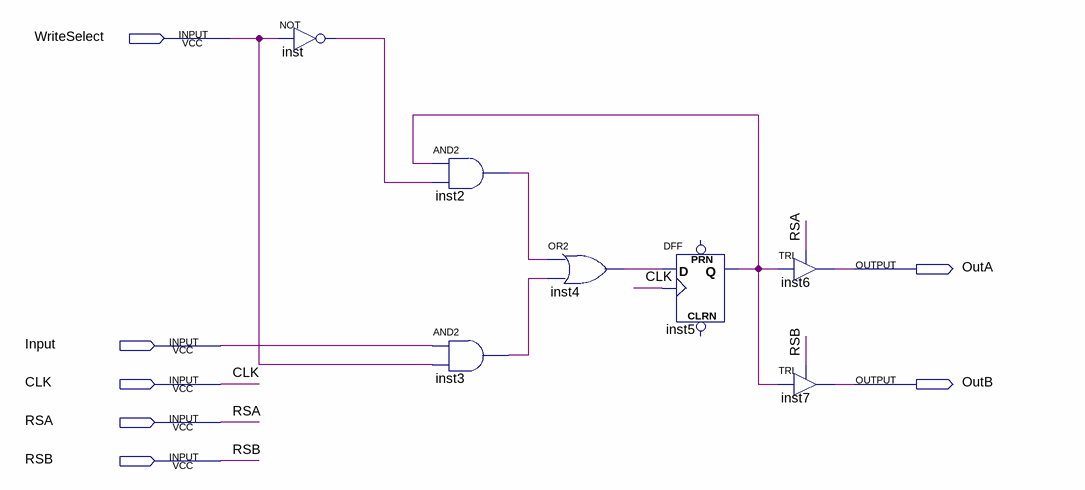
[diagram p0: schematic sheet]
// Quartus schematic rfc.bdf as structural Verilog: 7 symbols, 7 pins
module rfc (
  input  WriteSelect,
  input  Input,
  input  CLK,
  input  RSA,
  input  RSB,
  output OutA,
  output OutB
);

  wire inst2_out, inst3_out, inst4_out, inst5_q, inst_out;

  not inst (inst_out, WriteSelect);
  and inst2 (inst2_out, inst5_q, inst_out);
  and inst3 (inst3_out, Input, WriteSelect);
  or inst4 (inst4_out, inst2_out, inst3_out);
  DFF inst5 (.CLK(CLK), .D(inst4_out), .Q(inst5_q));  // open: CLRN, PRN
  TRI inst6 (.IN(inst5_q), .OE(RSA), .OUT(OutA));
  TRI inst7 (.IN(inst5_q), .OE(RSB), .OUT(OutB));
endmodule
